# Altium project WBO_Sensor_v0.1.PrjPcb
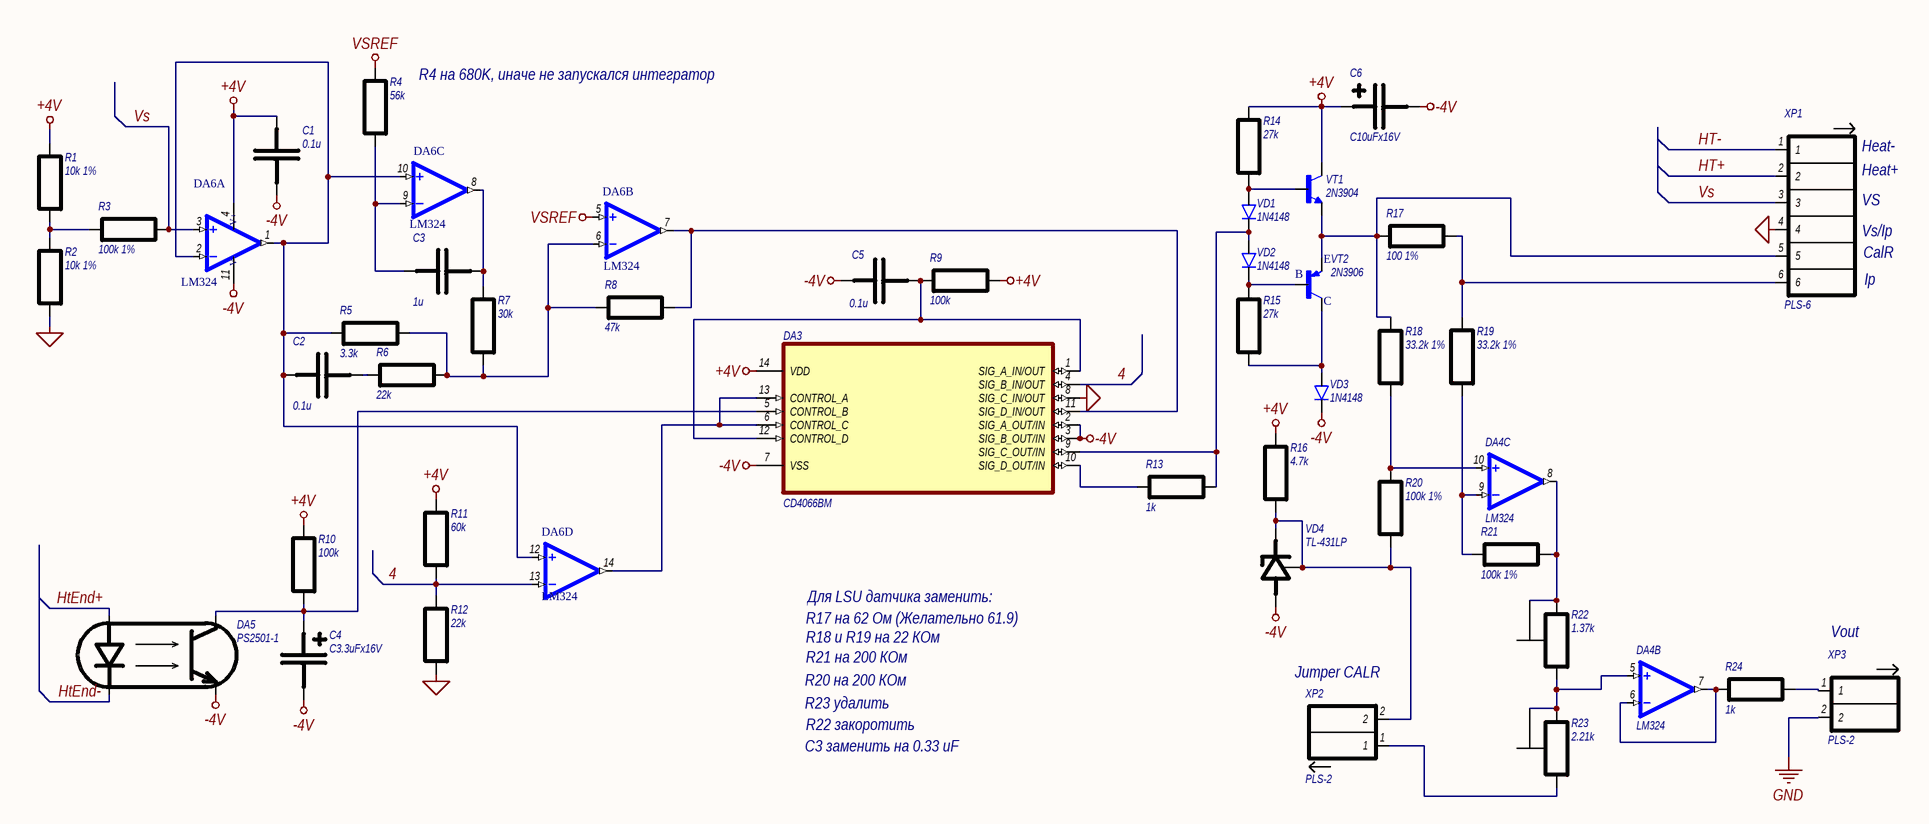
[diagram p0: Main.SchDoc]
3 sheets, 74 parts. Net scope: global (net labels, ports and power ports of the same name join across sheets).
Board file: PCB.PcbDoc
Sheets:
  Main.SchDoc
  Power.SchDoc
  Heater.SchDoc

## Sheet Main.SchDoc: {Наименование}
size 420 x 297 mm; ApprovedBy: {Утвердил}; CheckedBy: {Проверил}; DrawnBy: {Разработал}; Engineer: {Инженер}; DocumentNumber: {Обозначение}; SheetNumber: {}; SheetTotal: {}; Scale: {Масш.}; Title1str: {Наименование}; PageSetup: Record=PageOptions|CenterHorizontal=False|CenterVertical=False|PrintScale=0.95|XCorrection=0.00|YCorrection=0.00|PrintKind=1|BorderSize=5000000|LeftOffset=0|BottomOffset=0|Orientation=1|PaperLength=1000|PaperWidth=1000|Scale=100|PaperSource=15|PrintQuality=600|MediaType=1|DitherType=10|PaperKind=A4|PrintScaleMode=1; Title2str: {Наименование}; ProcessInspection: {Т.контр.}; Mass: {Масса}; NormInspection: {Н.контр.}; EngineerName: {Инженер}; Letter1Column: {}; Letter2Column: {}; Letter3Column: {}; DocumentType: {Документ}; DocumentType1str: {Документ}; DocumentType2str: {Документ}; ImagePath: {Перв. применение}; Rule: PcbType=ProtelPcb

### Parts
C1  0.1u  [CR2012-0805]
C2  0.1u  [CR2012-0805]
C3  1u  [CR2012-0805]
C4  C3.3uFx16V  [C6.3x11]
C5  0.1u  [CR2012-0805]
C6  C10uFx16V  [C6.3x11]
DA3  CD4066BM  [SOIC127P600X175-14N]
DA4  LM324  [SOIC127P600X175-14N]  (parts B,C of 4)
DA5  PS2501-1  [DIP4-Gull Wing]
DA6  LM324  [SOIC127P600X175-14N]  (parts A,B,C,D of 4)
R1  10k 1%  [CR2012-0805]
R2  10k 1%  [CR2012-0805]
R3  100k 1%  [CR2012-0805]
R4  56k  [CR2012-0805]
R5  3.3k  [CR2012-0805]
R6  22k  [CR2012-0805]
R7  30k  [CR2012-0805]
R8  47k  [CR2012-0805]
R9  100k  [CR2012-0805]
R10  100k  [CR2012-0805]
R11  60k  [CR2012-0805]
R12  22k  [CR2012-0805]
R13  1k  [CR2012-0805]
R14  27k  [CR2012-0805]
R15  27k  [CR2012-0805]
R16  4.7k  [CR2012-0805]
R17  100 1%  [CR3216-1206]
R18  33.2k 1%  [CR2012-0805]
R19  33.2k 1%  [CR2012-0805]
R20  100k 1%  [CR2012-0805]
R21  100k 1%  [CR2012-0805]
R22  1.37k  [3296W]
R23  2.21k  [3296W]
R24  1k  [CR2012-0805]
VD1  1N4148  [DO35-10]
VD2  1N4148  [DO35-10]
VD3  1N4148  [DO35-10]
VD4  TL-431LP  [TO-92]
VT1  2N3904  [TO-92]
VT2  2N3906  [TO-92]
XP1  PLS-6  [PLS-6]
XP2  PLS-2  [PLS-2]
XP3  PLS-2  [PLS-2]

### Nets
+4V: C1.1 C6.1 DA3.14(VDD) DA6.4(VCC+) R1.2 R9.2 R10.2 R11.2 R14.2 R16.2 VT1.3(C)
-4V: C1.2 C4.2 C5.1 C6.2 DA3.2(SIG_A_OUT/IN) DA3.3(SIG_B_OUT/IN) DA3.7(VSS) DA5.3(E) DA6.11(VCC-) VD3.C VD4.2(A) XP3.2  [also labelled GND]
SGND: DA3.8(SIG_C_IN/OUT) R2.1 R12.1 XP1.4
VSREF: DA6.5(NON-INVERTING_INPUT2) R4.2
4: DA3.4(SIG_B_IN/OUT) DA6.13(INVERTING_INPUT4) R11.1 R12.2
HT+: DA5.1(A) XP1.2  [also labelled HtEnd+]
HT-: XP1.1
HtEnd-: DA5.2(K)
Vs: DA6.3(NON-INVERTING_INPUT1) R3.2 XP1.3
NetC2_1: C2.1 DA6.1(OUTPUT1) DA6.2(INVERTING_INPUT1) DA6.10(NON-INVERTING_INPUT3) DA6.12(NON-INVERTING_INPUT4) R5.1
NetC2_2: C2.2 R6.1
NetC3_1: C3.1 DA6.9(INVERTING_INPUT3) R4.1
NetC3_2: C3.2 DA6.8(OUTPUT3) R7.2
NetC4_1: C4.1 DA3.5(CONTROL_B) DA5.4(C) R10.1
NetC5_2: C5.2 DA3.1(SIG_A_IN/OUT) DA3.12(CONTROL_D) R9.1
NetDA3_6: DA3.6(CONTROL_C) DA3.13(CONTROL_A) DA6.14(OUTPUT4)
NetDA3_9: DA3.9(SIG_C_OUT/IN) R13.2 VD1.C VD2.A
NetDA3_10: DA3.10(SIG_D_OUT/IN) R13.1
NetDA3_11: DA3.11(SIG_D_IN/OUT) DA6.7(OUTPUT2) R8.2
NetDA4_5: DA4.5(NON-INVERTING_INPUT2) R22.1 R23.2 R23.3
NetDA4_6: DA4.6(INVERTING_INPUT2) DA4.7(OUTPUT2) R24.1
NetDA4_8: DA4.8(OUTPUT3) R21.2 R22.2 R22.3
NetDA4_9: DA4.9(INVERTING_INPUT3) R19.1 R21.1
NetDA4_10: DA4.10(NON-INVERTING_INPUT3) R18.1 R20.2
NetDA6_6: DA6.6(INVERTING_INPUT2) R5.2 R6.2 R7.1 R8.1
NetR1_1: R1.1 R2.2 R3.1
NetR14_1: R14.1 VD1.A VT1.2(B)
NetR15_1: R15.1 VD3.A VT2.3(C)
NetR15_2: R15.2 VD2.C VT2.2(B)
NetR16_1: R16.1 R20.1 VD4.1(K) VD4.3(REF) XP2.2
NetR17_1: R17.1 R18.2 VT1.1(E) VT2.1(E) XP1.5
NetR17_2: R17.2 R19.2 XP1.6
NetR23_1: R23.1 XP2.1
NetR24_2: R24.2 XP3.1

### Notes on the sheet
- (near R4) R4 на 680K, иначе не запускался интегратор
- VS
- Heat-
- Heat+
- Vs/Ip
- CalR
- Ip
- Для LSU датчика заменить:
- R17 на 62 Ом (Желательно 61.9)
- R18 и R19 на 22 КОм
- R21 на 200 КОм
- Vout
- R20 на 200 КОм
- R23 удалить
- R22 закоротить
- (near XP2) Jumper CALR
- C3 заменить на 0.33 uF
- Перв. примен.
- Справ. №
- Подп. и дата
- Инв. № дубл.
- Взам. инв. №
- Изм.
- Лист
- № докум.
- Подп.
- Дата
- Лит.
- Масса
- Масштаб
- Т.контр.
- Пров.
- Разраб.
- Листов
- Инв. № подл.
- Н.контр.
- Утв.
- Копировал
- Формат А3
- (in symbol LM324, part A) V+; V-

### Library data of the parts
C1 C2 C5 = C0805-0.1u-X7R
C3 = C0805-1u-X7R
C4 = C10uFx16V
DA3 = CD4066BM: Bilateral, FET Switches 1 x 1:1 14-SOIC; MF: Texas Instruments; Value: *; Package: SOIC-14 Texas Instruments; MP: CD4066BM; Price: None; Availability: Unavailable; SnapEDA_Link: https://www.snapeda.com/parts/CD4066BM/Texas%20Instruments/view-part/342060/?ref=snap
DA4 DA6 = LM324: General Purpose Amplifier 4 Circuit 14-SOIC; MF: Texas Instruments; Price: None; MP: LM324; Package: SOIC-14 Texas Instruments; Value: *; Availability: Unavailable; SnapEDA_Link: https://www.snapeda.com/parts/LM324/Texas%20Instruments/view-part/2758578/?ref=snap
R1 R2 = R0805-10k-1%
R3 R9 R10 R20 R21 = R0805-100k-5%
R4 = R0805-51k-5%
R5 = R0805-3k3-5%
R6 R12 R14 R15 = R0805-22k-5%
R7 = R0805-30k-5%
R8 R11 = R0805-47k-5%
R13 R24 = R0805-1k-5%
R16 = R0805-4k7-5%
R17 = R1206-100-5%
R18 R19 = R0805-33k-5%
R22 R23 = 3296W-1-103
VD1-VD3 = 1N4148: Diode Standard 100V 200mA Through Hole DO-35; MF: Nexperia USA Inc.; MP: 1N4148; Availability: Unavailable; SnapEDA_Link: https://www.snapeda.com/parts/1N4148/Nexperia%20USA%20Inc./view-part/4413009/?ref=snap; Value: *; Package: DO-35 Nexperia USA Inc.; Price: None
VT1 = 2N3904: TO-92; MF: Rectron; MP: 2N3904; SnapEDA_Link: https://www.snapeda.com/parts/2N3904/Rectron/view-part/4705619/?ref=snap; Price: None; Package: None; Value: *; Availability: Unavailable
VT2 = 2N3906: TRANS PNP 40V 0.2A TO92; MF: Diotec Semiconductor; Value: *; MP: 2N3906; Package: TO-226-3 Diotec Semiconductor; Price: None; SnapEDA_Link: https://www.snapeda.com/parts/2N3906/Diotec/view-part/4705783/?ref=snap; Availability: Unavailable

## Sheet Power.SchDoc: {Наименование}
size 420 x 297 mm; ApprovedBy: {Утвердил}; CheckedBy: {Проверил}; DrawnBy: {Разработал}; Engineer: {Инженер}; DocumentNumber: {Обозначение}; SheetNumber: {}; SheetTotal: {}; Scale: {Масш.}; Title1str: {Наименование}; PageSetup: Record=PageOptions|CenterHorizontal=False|CenterVertical=False|PrintScale=0.95|XCorrection=0.00|YCorrection=0.00|PrintKind=1|BorderSize=5000000|LeftOffset=0|BottomOffset=0|Orientation=1|PaperLength=1000|PaperWidth=1000|Scale=100|PaperSource=15|PrintQuality=600|MediaType=1|DitherType=10|PaperKind=A4|PrintScaleMode=1; Title2str: {Наименование}; ProcessInspection: {Т.контр.}; Mass: {Масса}; NormInspection: {Н.контр.}; EngineerName: {Инженер}; Letter1Column: {}; Letter2Column: {}; Letter3Column: {}; DocumentType: {Документ}; DocumentType1str: {Документ}; DocumentType2str: {Документ}; ImagePath: {Перв. применение}; Rule: PcbType=ProtelPcb
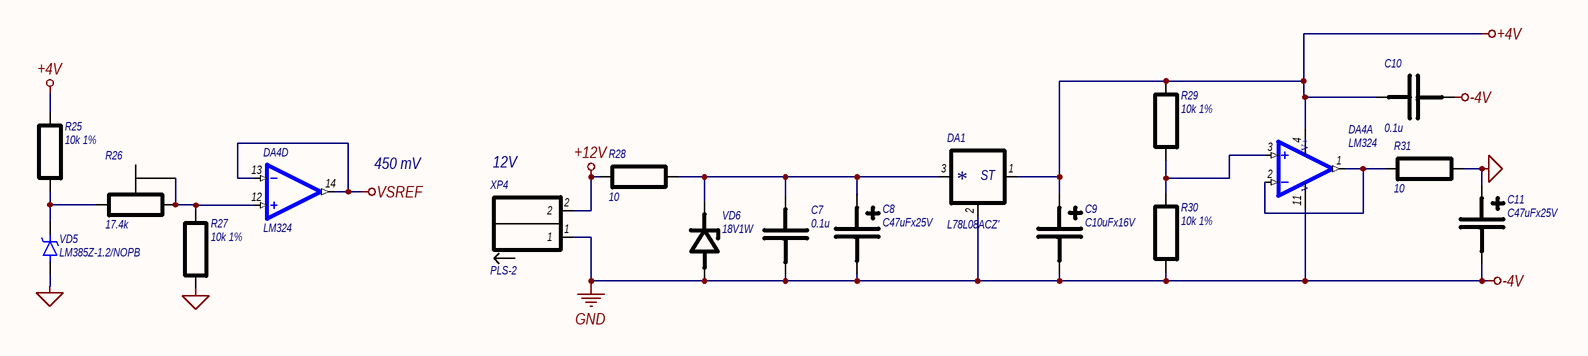
[diagram p1: Power.SchDoc]

### Parts
C7  0.1u  [CR2012-0805]
C8  C47uFx25V  [C6.3x11]
C9  C10uFx16V  [C6.3x11]
C10  0.1u  [CR2012-0805]
C11  C47uFx25V  [C6.3x11]
DA1  L78L08ACZ'  [to-92]
DA4  LM324  [SOIC127P600X175-14N]  (parts A,D of 4)
R25  10k 1%  [CR2012-0805]
R26  17.4k  [3296W]
R27  10k 1%  [CR2012-0805]
R28  10  [R-1W]
R29  10k 1%  [CR2012-0805]
R30  10k 1%  [CR2012-0805]
R31  10  [R-1W]
VD5  LM385Z-1.2/NOPB  [DIO_LM385Z-2.5/NOPB]
VD6  18V1W  [DO-41]
XP4  PLS-2  [PLS-2]

### Nets
+4V: C9.1 C10.1 DA1.1(Vout) DA4.4(VCC+) R25.2 R29.2
+12V: R28.1 XP4.2
-4V: C7.2 C8.2 C9.2 C10.2 C11.2 DA1.2(GND) DA4.11(VCC-) R30.1 VD6.1(A) XP4.1  [also labelled GND]
SGND: C11.1 R27.1 R31.2 VD5.1(A)
VSREF: DA4.13(INVERTING_INPUT4) DA4.14(OUTPUT4)
NetC7_1: C7.1 C8.1 DA1.3(Vin) R28.2 VD6.2(K)
NetDA4_1: DA4.1(OUTPUT1) DA4.2(INVERTING_INPUT1) R31.1
NetDA4_3: DA4.3(NON-INVERTING_INPUT1) R29.1 R30.2
NetDA4_12: DA4.12(NON-INVERTING_INPUT4) R26.2 R26.3 R27.2
NetR25_1: R25.1 R26.1 VD5.2(C)

### Notes on the sheet
- (near DA4) 450 mV
- 12V
- Перв. примен.
- Справ. №
- Подп. и дата
- Инв. № дубл.
- Взам. инв. №
- Изм.
- Лист
- № докум.
- Подп.
- Дата
- Лит.
- Масса
- Масштаб
- Т.контр.
- Пров.
- Разраб.
- Листов
- Инв. № подл.
- Н.контр.
- Утв.
- Копировал
- Формат А3
- (in symbol L78L08ACZ') ST
- (in symbol LM324, part A) V+; V-

### Library data of the parts
C7 C10 = C0805-0.1u-X7R
DA4 = LM324: as DA4 on sheet Main; Price: None; MP: LM324; Package: SOIC-14 Texas Instruments; Value: *; Availability: Unavailable; SnapEDA_Link: https://www.snapeda.com/parts/LM324/Texas%20Instruments/view-part/2758578/?ref=snap
R25 R27 R29 R30 = R0805-10k-1%
R26 = 3296W-1-103
R28 R31 = R-1W-10R
VD5 = LM385Z-2.5/NOPB: Shunt Voltage Reference IC Â±3% TO-92-3; MF: ON Semiconductor; Price: None; Package: TO-92 ON Semiconductor; Availability: Unavailable; SnapEDA_Link: https://www.snapeda.com/parts/LM385Z-2.5/ON%20Semiconductor/view-part/6788/?ref=snap; Value: *; MP: LM385Z-2.5
VD6 = 1N4746A

## Sheet Heater.SchDoc: {Наименование}
size 420 x 297 mm; ApprovedBy: {Утвердил}; CheckedBy: {Проверил}; DrawnBy: {Разработал}; Engineer: {Инженер}; DocumentNumber: {Обозначение}; SheetNumber: {}; SheetTotal: {}; Scale: {Масш.}; Title1str: {Наименование}; PageSetup: Record=PageOptions|CenterHorizontal=False|CenterVertical=False|PrintScale=0.95|XCorrection=0.00|YCorrection=0.00|PrintKind=1|BorderSize=5000000|LeftOffset=0|BottomOffset=0|Orientation=1|PaperLength=1000|PaperWidth=1000|Scale=100|PaperSource=15|PrintQuality=600|MediaType=1|DitherType=10|PaperKind=A4|PrintScaleMode=1; Title2str: {Наименование}; ProcessInspection: {Т.контр.}; Mass: {Масса}; NormInspection: {Н.контр.}; EngineerName: {Инженер}; Letter1Column: {}; Letter2Column: {}; Letter3Column: {}; DocumentType: {Документ}; DocumentType1str: {Документ}; DocumentType2str: {Документ}; ImagePath: {Перв. применение}; Rule: PcbType=ProtelPcb
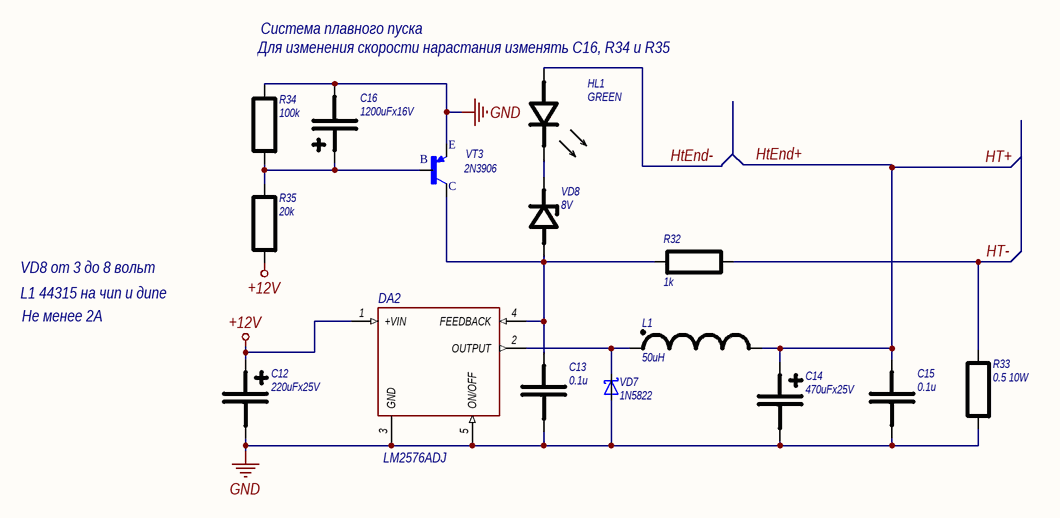
[diagram p2: Heater.SchDoc]

### Parts
C12  220uFx25V  [C8x11.5]
C13  0.1u  [CR2012-0805]
C14  470uFx25V  [C10x16]
C15  0.1u  [CR2012-0805]
C16  1200uFx16V  [C8x20]
DA2  LM2576ADJ  [TO220-5]
HL1  GREEN  [CR3216-1206-LED]
L1  50uH  [RCH114]
R32  1k  [CR2012-0805]
R33  0.5 10W  [R-1W]
R34  100k  [CR2012-0805]
R35  20k  [CR2012-0805]
VD7  1N5822  [DIOAD2120W130L950D530P]
VD8  8V  [SOD-80]
VT3  2N3906  [TO-92]

### Nets
+12V: C12.1 DA2.1(+VIN) R35.1
GND: C12.2 C13.2 C14.2 C15.2 C16.2 DA2.3(GND) DA2.5(ON/OFF) R33.1 R34.2 VD7.A VT3.1(E)  [project net -4V]
HT+: C14.1 C15.1 L1.2  [also labelled HtEnd+]
HT-: R32.2 R33.2
HtEnd-: HL1.1(A)
NetC13_1: C13.1 DA2.4(FEEDBACK) R32.1 VD8.1(A) VT3.3(C)
NetC16_1: C16.1 R34.1 R35.2 VT3.2(B)
NetDA2_2: DA2.2(OUTPUT) L1.1 VD7.C
NetHL1_2: HL1.2(K) VD8.2(K)

### Notes on the sheet
- Для изменения скорости нарастания изменять С16, R34 и R35
- Система плавного пуска
- VD8 от 3 до 8 вольт
- L1 44315 на чип и дипе
- Не менее 2А
- Перв. примен.
- Справ. №
- Подп. и дата
- Инв. № дубл.
- Взам. инв. №
- Изм.
- Лист
- № докум.
- Подп.
- Дата
- Лит.
- Масса
- Масштаб
- Т.контр.
- Пров.
- Разраб.
- Листов
- Инв. № подл.
- Н.контр.
- Утв.
- Копировал
- Формат А3

### Library data of the parts
C12 = C220uFx25V YAGEO SY: SY025M0220A3F-0811
C13 C15 = C0805-0.1u-X7R
C14 = C470uFx25V KF
C16 = C1000uFx16V LZ
DA2 = LM2576ADJ: <B>LM 2576 Adj</B><br> SIMPLE SWITCHER 3-A Step-Down Voltage Regulator; MF: ON Semiconductor; Availability: Unavailable; Price: None; Package: None; Value: *; SnapEDA_Link: https://www.snapeda.com/parts/LM2576ADJ/ON%20Semiconductor/view-part/543608/?ref=snap; MP: LM2576ADJ
HL1 = LED_GREEN_1206
L1 = RCH114NP-221KB
R32 = R0805-1k-5%
R33 = R-1W-5R1
R34 = R0805-100k-5%
R35 = R0805-20k-5%
VD7 = 1N5822: Diode Schottky 40V 3A Through Hole; MF: ON Semiconductor; Package: DO-201AD-201 Panjit; MP: 1N5822; Value: *; SnapEDA_Link: https://www.snapeda.com/parts/1N5822/ON%20Semiconductor/view-part/1356736/?ref=snap; Price: None; Availability: Unavailable
VD8 = BZV55-C3V0
VT3 = 2N3906: as VT2 on sheet Main; Value: *; MP: 2N3906; Package: TO-226-3 Diotec Semiconductor; Price: None; SnapEDA_Link: https://www.snapeda.com/parts/2N3906/Diotec/view-part/4705783/?ref=snap; Availability: Unavailable

## Nets that join several sheets
+4V: Main (11 pins), Power (6 pins)
+12V: Power (R28.1 XP4.2), Heater (C12.1 DA2.1 R35.1)
-4V: Main (12 pins), Power (10 pins), Heater (11 pins)
SGND: Main (DA3.8 R2.1 R12.1 XP1.4), Power (C11.1 R27.1 R31.2 VD5.1)
VSREF: Main (DA6.5 R4.2), Power (DA4.13 DA4.14)
HT+: Main (DA5.1 XP1.2), Heater (C14.1 C15.1 L1.2)
HT-: Main (XP1.1), Heater (R32.2 R33.2)
HtEnd-: Main (DA5.2), Heater (HL1.1)